# EAGLE design schemat1 (EAGLE 8.4.3)
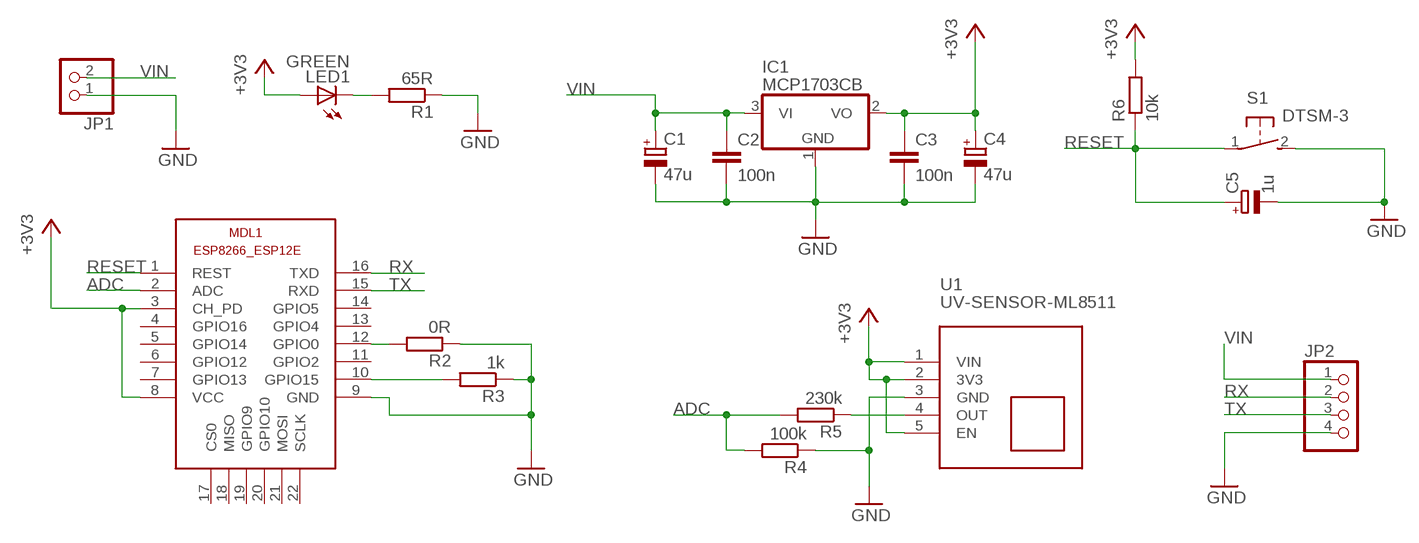
[diagram p0: schematic, sheet 1]

## Parts
C1  47u  CPOL-EUCT3528  [CT3528]
C2  100n  C-EUC0805  [C0805]
C3  100n  C-EUC0805  [C0805]
C4  47u  CPOL-EUCT3528  [CT3528]
C5  1u  CPOL-EUCT3216  [CT3216]
IC1  MCP1703CB  [SOT23]
JP1  PINHD-1X2  [1X02]
JP2  PINHD-1X4/90  [1X04/90]
LED1  GREEN  LED_E  [LED_1206]
MDL1  ESP8266-12EESP8266-ESP12E  [ESP8266-ESP12E]
R1  65R  R-EU_R0805  [R0805]
R2  0R  R-EU_R0805  [R0805]
R3  1k  R-EU_R0805  [R0805]
R4  100k  R-EU_R0805  [R0805]
R5  230k  R-EU_R0805  [R0805]
R6  10k  R-EU_R0805  [R0805]
S1  DTSM-3  [DTSM-3]
U1  UV-SENSOR-ML8511  [UV-SENSOR-ML8511]

## Nets
+3V3: C3.1 C4.+ IC1.2(VO) LED1.A MDL1.3(CH_PD) MDL1.8(VCC) R6.2 U1.1(VIN) U1.2(3V3) U1.5(EN)
ADC: MDL1.2(ADC) R4.2 R5.2
GND: C1.- C2.2 C3.2 C4.- C5.- IC1.1(GND) JP1.1 JP2.4 MDL1.9(GND) R1.1 R2.1 R3.1 R4.1 S1.2 U1.3(GND)
N$1: R5.1 U1.4(OUT)
N$2: LED1.C R1.2
N$3: MDL1.12(GPIO0) R2.2
N$5: MDL1.10(GPIO15) R3.2
RESET: C5.+ MDL1.1(REST) R6.1 S1.1
RX: JP2.2 MDL1.16(TXD)
TX: JP2.3 MDL1.15(RXD)
VIN: C1.+ C2.1 IC1.3(VI) JP1.2 JP2.1
Unconnected: MDL1.4(GPIO16) MDL1.5(GPIO14) MDL1.6(GPIO12) MDL1.7(GPIO13) MDL1.11(GPIO2) MDL1.13(GPIO4) MDL1.14(GPIO5) MDL1.17(CS0) MDL1.18(MISO) MDL1.19(GPIO9) MDL1.20(GPIO10) MDL1.21(MOSI) MDL1.22(SCLK)

## Library data of the parts
C1 C4 C5 = rcl:CPOL-EU: POLARIZED CAPACITOR, European symbol; SPICEPREFIX: C
C2 C3 = rcl:C-EU: CAPACITOR, European symbol
IC1 = linear:MCP1703: 250 mA, 16V, Low Quiescent Current LDO Regulator Source: http://ww1.microchip.com/downloads/en/DeviceDoc/22049b.pdf
JP1 = pinhead:PINHD-1X2: PIN HEADER
JP2 = pinhead:PINHD-1X4: PIN HEADER
LED1 = eagle-ltspice:LED_E: LED Source: http://www.osram.convergy.de Source: www.luxeon.com Source: www.kingbright.com; SPICEMODEL: NONE; SPICEPREFIX: D; SPICETYPE: diode
MDL1 = ESP8266-ESP12E:ESP8266-12E: ESP8266-12E with additional I/O and GPIO04/05 corrected The author cannot warrant that this library is free from error or will meet your specific requirements. Created by PuceBaboon.com. Komagane, Nagano, JAPAN
R1-R6 = rcl:R-EU_: RESISTOR, European symbol
S1 = switch-tact:DTSM-3
U1 = diy-modules:UV-SENSOR-ML8511: UV Sensor based on ML8511 device ML8511 user's guide is available here: https://learn.sparkfun.com/tutorials/ml8511-uv-sensor-hookup-guide/using-the-ml8511 ML8511 datasheet is available here: https://www.mcs.anl.gov/research/projects/waggle/downloads/datasheets/lightsense/ml8511.pdf Click here to find device on ebay.com <http://www.ebay.com/sch/ml8511+module>

## Board
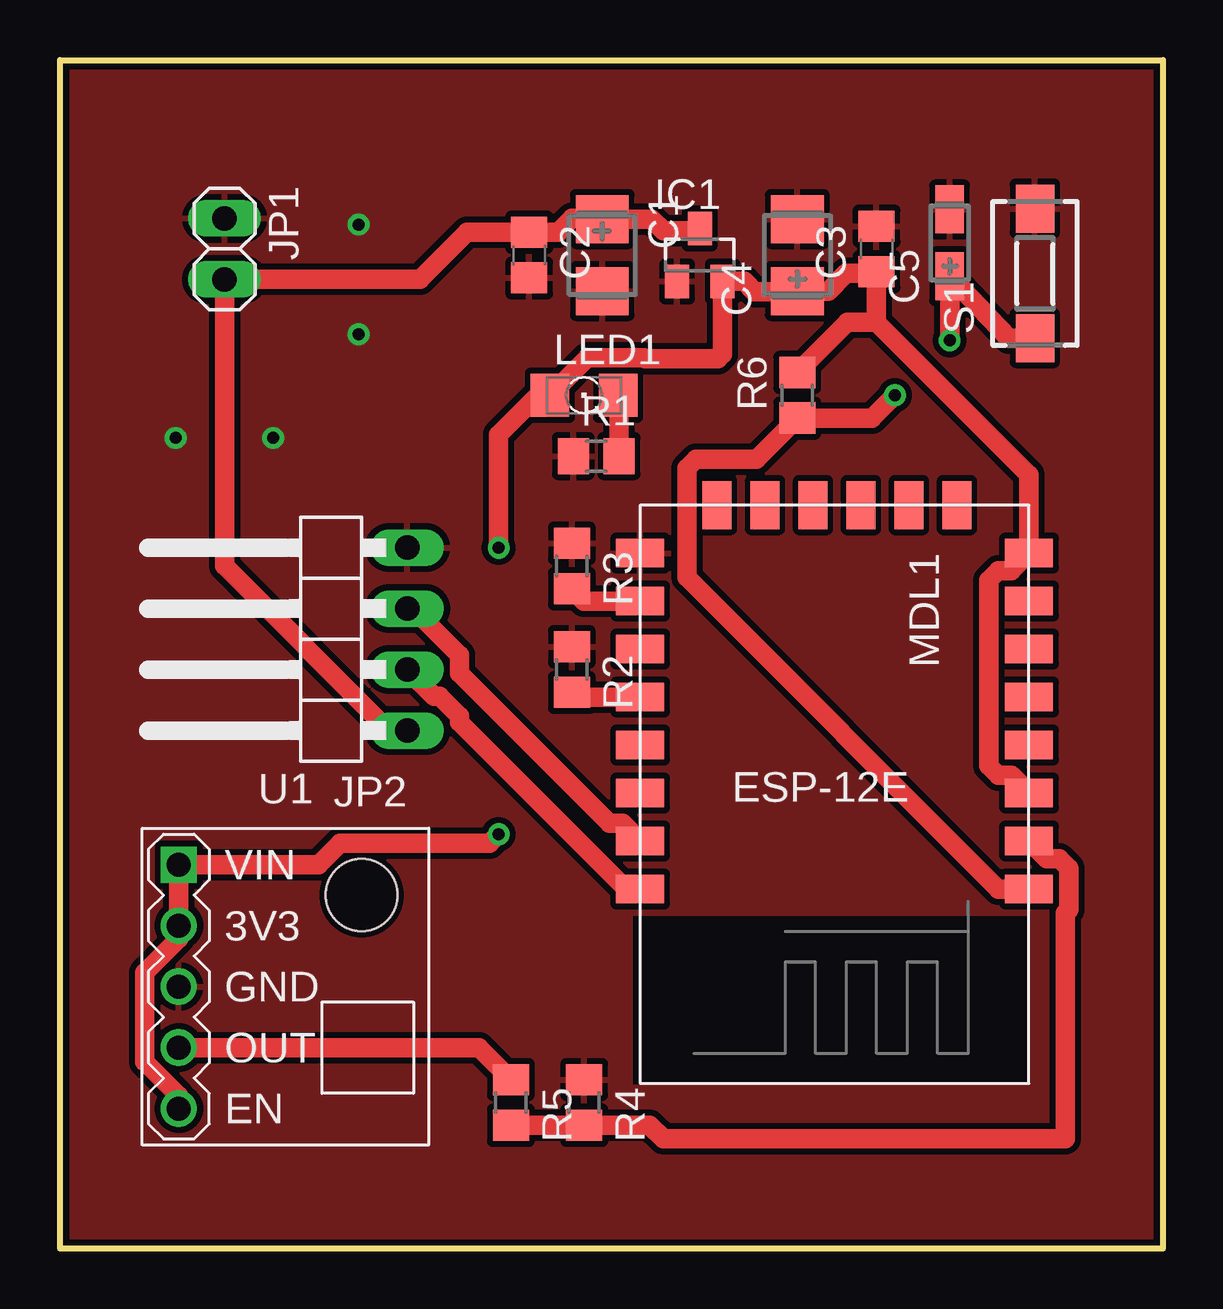
[diagram p1: board, top side]
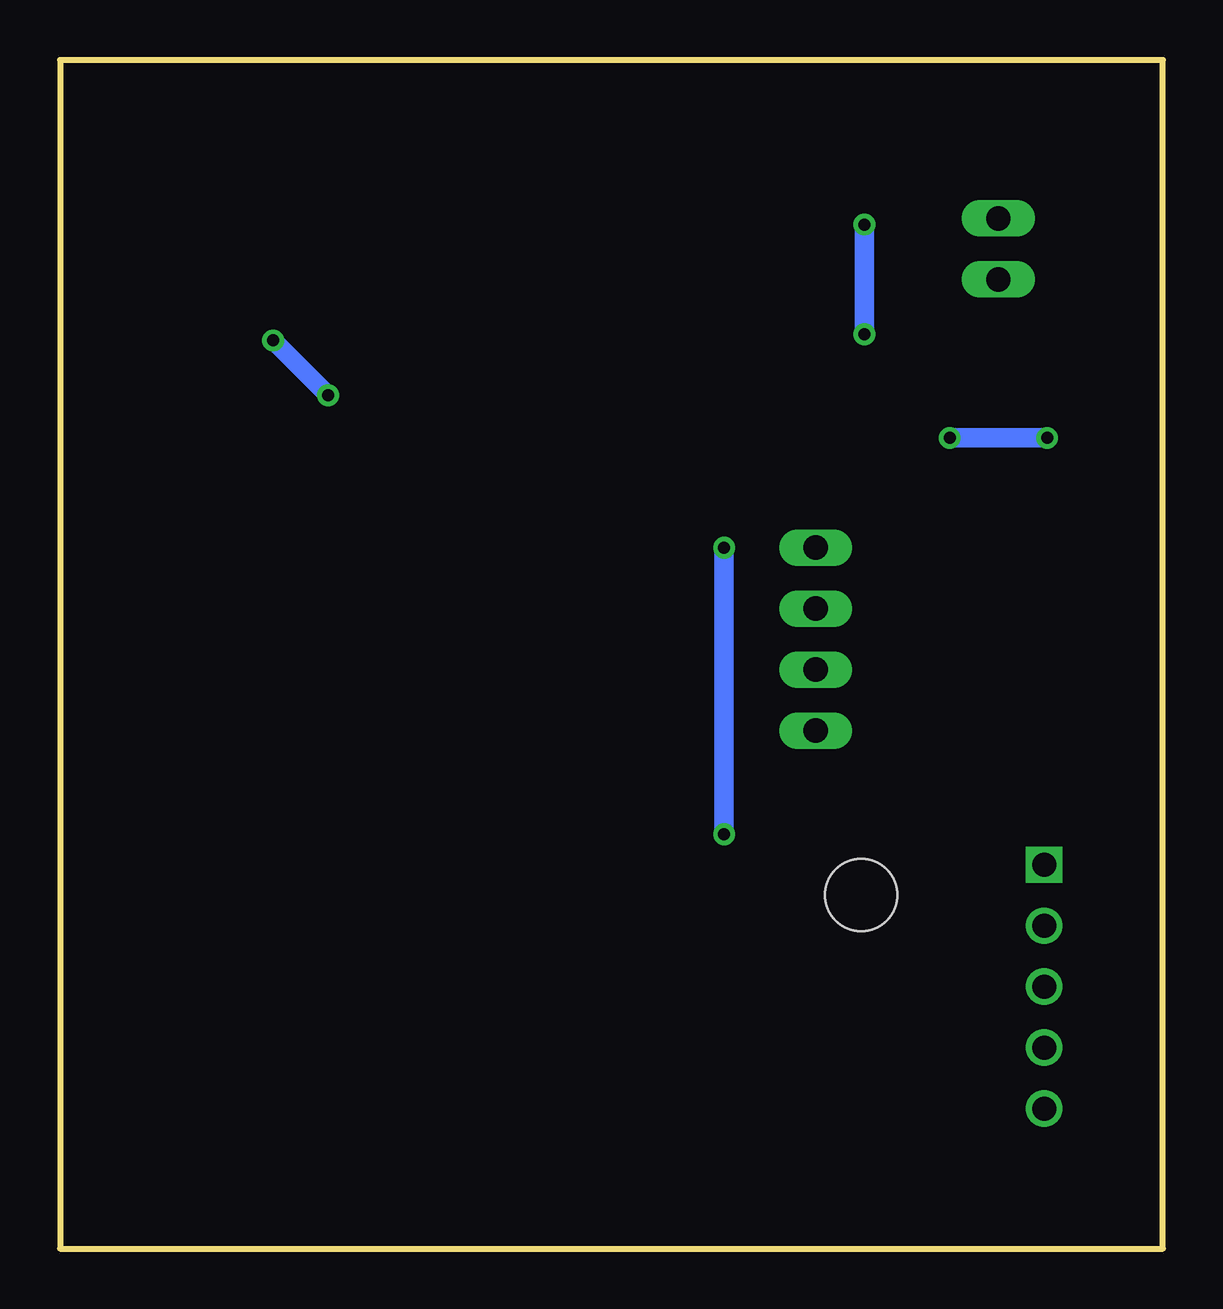
[diagram p2: board, bottom side, seen from below]

Size 45.97 x 49.53 mm. Coordinates in mm from the lower left corner, seen from the top.
Outline: 0,49.53 45.97,49.53 45.97,0 0,0 0,49.53
Copper layers (1*16): Top 0.035mm / dielectric 1.5mm / Bottom 0.035mm
Design rules "default *": minimum track width 10mil, minimum drill 0.35mm, track to track 10mil, track to pad 10mil, pad to pad 10mil, via to via 10mil, smd to smd 10mil, copper to edge 10mil, drill to drill 6mil, minimum pad ring 10mil, minimum via ring 8mil, stop-mask expansion 10mil, vias tented up to drill 0mil, thermal gap 10mil

### Footprints (pad centres in the part's own frame; a part is rotated, then mirrored left to right if it is on the bottom)
CT3528 = smd 2 x 2.2: + -1.5,0; - 1.5,0
C0805 = smd 1.3 x 1.5: 1 -0.95,0; 2 0.95,0
CT3216 = smd 2 x 1.2: + -1.4,0; - 1.4,0
SOT23 = smd 1 x 1.4: 1 -0.95,-1.1; 2 0.95,-1.1; 3 0,1.1
1X02 = drill 1.016 long: 1 -1.27,0; 2 1.27,0
1X04/90 = drill 1.016 long: 1 -3.81,-3.81; 2 -1.27,-3.81; 3 1.27,-3.81; 4 3.81,-3.81
LED_1206 = smd 1.6 x 1.803: A -1.422,0; C 1.422,0
ESP8266-ESP12E = smd 2 x 1.2: 1 -7.62,5.84; 2 -7.62,3.84; 3 -7.62,1.84; 4 -7.62,-0.16; 5 -7.62,-2.16; 6 -7.62,-4.16; 7 -7.62,-6.16; 8 -7.62,-8.16; 9 8.58,-8.16; 10 8.58,-6.16; 11 8.58,-4.16; 12 8.58,-2.16; 13 8.58,-0.16; 14 8.58,1.84; 15 8.58,3.84; 16 8.58,5.84 | smd 1.2 x 2: 17 -4.62,-10.16; 18 -2.62,-10.16; 19 -0.62,-10.16; 20 1.38,-10.16; 21 3.38,-10.16; 22 5.38,-10.16
R0805 = smd 1.3 x 1.5: 1 -0.95,0; 2 0.95,0
DTSM-3 = smd 2 x 1.6: 1 -2.7,0; 2 2.7,0
UV-SENSOR-ML8511 = drill 1 square: 1 -4.445,5.08 | drill 1: 2 -4.445,2.54; 3 -4.445,0; 4 -4.445,-2.54; 5 -4.445,-5.08 | hole 3: 3.175,3.81

### Placement (x,y rotation side)
C1  22.61,41.4 270 top
C2  19.56,41.4 270 top
C3  34.04,41.66 90 top
C4  30.73,41.4 90 top
C5  37.08,41.91 90 top
IC1  26.67,41.4 0 top
JP1  6.86,41.66 270 top
JP2  10.67,25.4 90 top
LED1  21.84,35.56 0 top
MDL1  32.77,20.83 180 top
R1  22.35,33.02 0 top
R2  21.34,24.13 270 top
R3  21.34,28.45 270 top
R4  21.84,6.1 270 top
R5  18.8,6.1 270 top
R6  30.73,35.56 90 top
S1  40.64,40.64 90 top
U1  9.4,10.92 0 top

### Tracks (layer width: path | path; a pad name or v marks a point on that pad's centre or on a via)
+3V3  (via drill 0.5)
  Top 0.813: 34.04,38.61 C3.1 33.97,40.64 32.77,40.64 32.03,39.9 C4.+ 30.71,39.88 28.96,39.88 28.53,40.3 IC1.2 27.62,37.27 27.43,37.08 24.38,37.08 24.34,37.12 21.98,37.12 LED1.A 19.93,35.56 18.29,33.92 v18.29,29.21 | 34.04,38.61 40.39,32.26 MDL1.8 39.65,28.25 39.11,28.25 38.73,27.86 38.73,20.11 39.11,19.73 39.65,19.73 MDL1.3 | 34.04,38.61 32.83,38.61 R6.2 | v18.29,17.27 17.91,16.89 11.68,16.89 10.79,16 U1.1 U1.2 4.95,12.92 3.54,11.51 3.54,7.8 4.95,6.38 U1.5
  Bottom 0.813: v18.29,29.21 v18.29,17.27
ADC
  Top 0.813: R5.2 R4.2 24.57,5.15 25.15,4.57 41.91,4.57 41.91,13.98 42.05,14.11 42.05,15.86 41.66,16.25 41.13,16.25 MDL1.2
GND  (via drill 0.5)
  Bottom 0.813: v8.89,33.78 v4.83,33.78 | v12.45,38.1 v12.45,42.67
  pour Top: -4.06,51.05 48.01,51.05 48.26,-2.03 -3.81,-2.03
N$1
  Top 0.813: R5.1 17.46,8.38 U1.4
N$2
  Top 0.813: LED1.C 23.3,35.52 R1.2
N$3
  Top 0.813: R2.2 21.53,22.99 MDL1.12
N$5
  Top 0.813: R3.2 21.85,26.99 MDL1.10
RESET  (via drill 0.5)
  Top 0.813: S1.1 39.55,37.94 C5.+ v37.08,37.85 | v34.8,35.56 33.85,34.61 R6.1 29.03,32.9 26.51,32.9 26.13,32.52 26.13,27.98 39.11,14.99 MDL1.1
  Bottom 0.813: v37.08,37.85 v34.8,35.56
RX
  Top 0.813: MDL1.16 23.62,14.99 16.66,21.95 16.66,22.18 15.83,23.01 15.6,23.01 JP2.2
TX
  Top 0.813: MDL1.15 23.45,17.73 22.91,17.73 16.66,23.98 16.66,24.72 14.71,26.67 JP2.3
VIN
  Top 0.813: JP2.1 13.72,21.59 6.86,28.45 JP1.2 15.01,40.39 16.98,42.35 C2.1 20.76,42.35 21.34,42.93 22.58,42.93 C1.+ 24.66,42.9 25.15,42.42 26.59,42.42 IC1.3